# Altium schematic sheet Sheet1.SchDoc
size A
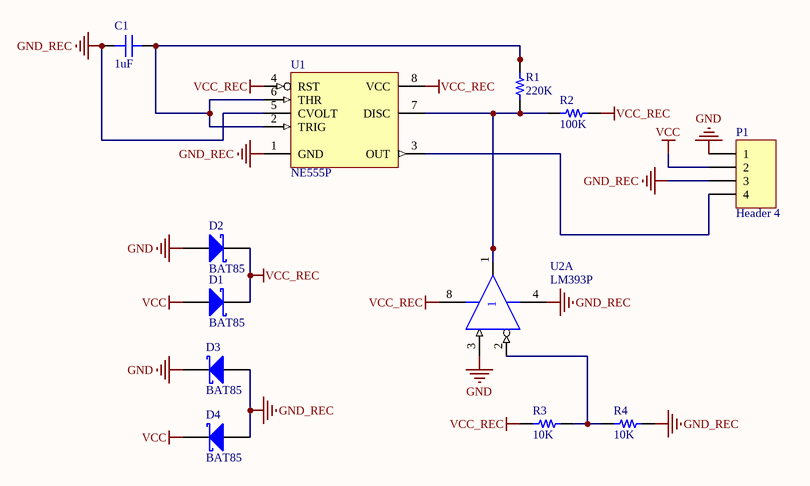
[diagram p0: Sheet1.SchDoc]

## Parts
C1  1uF  [CAP 0805/2012]
D1  BAT85  [SOD68]
D2  BAT85  [SOD68]
D3  BAT85  [SOD68]
D4  BAT85  [SOD68]
P1  Header 4  [HDR1X4]
R1  220K  [RES 0805/2012]
R2  100K  [RES 0805/2012]
R3  10K  [RES 0805/2012]
R4  10K  [RES 0805/2012]
U1  NE555P  [P008]
U2  LM393P  [P008]  (part A of 2)

## Nets
GND: D2.1(A) D3.2(K) P1.1 U2.3(IN+)
GND_REC: C1.1 D3.1(A) D4.1(A) P1.3 R4.1 U1.1(GND) U1.5(CVOLT) U2.4(GND)
VCC: D1.1(A) D4.2(K) P1.2
VCC_REC: D1.2(K) D2.2(K) R2.1 R3.2 U1.4(RST) U1.8(VCC) U2.8(VCC)
NetC1_2: C1.2 R1.2 U1.2(TRIG) U1.6(THR)
NetP1_4: P1.4 U1.3(OUT)
NetR1_1: R1.1 R2.2 U1.7(DISC) U2.1(OUT)
NetR3_1: R3.1 R4.2 U2.2(IN-)

## Library data of the parts
C1 = CC0805KRX7R9BB103: CAP CER 10000PF 50V X7R 0805; Manufacturer: Yageo; TemperatureRange: -55C ~ 125C; Tolerance: 10%; Value: 10000pF; Part Number: CC0805KRX7R9BB103; PartId: 5694; Supplier 1: Digi-Key; Supplier Part Number 1: 311-1136-2-ND; ComponentLink1Description: Datasheet; ComponentLink1URL: http://www.yageo.com/documents/recent/UPY-GPHC_X7R_6.3V-to-50V-v12.pdf; ComponentLink2Description: Digi-Key listing; ComponentLink2URL: http://digikey.com/product-detail/en/CC0805KRX7R9BB103/311-1136-2-ND/302870; TemperatureCoefficient: X7R; Voltage: 50V; Price: 0.0081; Type: -; Device Package: 0805 (2012 Metric)
D1-D4 = BAT85: Schottky Barrier Diode; Published: 17-Sep-2003; DatasheetVersion: 25-May-2000; PackageVersion: May-2000; PackageReference: SOD68; Publisher: Altium Limited; PackageDescription: Diode, Axial; Body 3 x 1.6 mm (LxDia. max), Lead Dia. 0.55 mm (max); Code_JEDEC: DO-204-AG; ComponentLink1Description: Manufacturer Link; ComponentLink1URL: http://www.semiconductors.philips.com/; ComponentLink2Description: Datasheet; ComponentLink2URL: http://www.semiconductors.philips.com/acrobat/datasheets/BAT85_4.pdf
P1 = Header 4: Header, 4-Pin; LatestRevisionDate: 17-Jul-2002; LatestRevisionNote: Re-released for DXP Platform.; Publisher: Altium Limited
R1-R4 = ERJ-6ENF49R9V: RES SMD 49.9 OHM 1% 1/8W 0805; Manufacturer: Panasonic Electronic Components; Value: 49.9; TemperatureRange: -55C ~ 155C; TemperatureCoefficient: 100ppm/C; PowerRating: 0.125W, 1/8W; Part Number: ERJ-6ENF49R9V; PartId: 1960; Supplier 1: Digi-Key; Supplier Part Number 1: P49.9CTR-ND; ComponentLink1Description: Datasheet; ComponentLink1URL: http://industrial.panasonic.com/www-cgi/jvcr13pz.cgi?E+PZ+3+AOA0002+ERJ6ENF49R9V+7+WW; ComponentLink2Description: Digi-Key listing; ComponentLink2URL: http://digikey.com/product-detail/en/ERJ-6ENF49R9V/P49.9CTR-ND/111027; Tolerance: 1%; Price: 0.0073; Type: Thick Film; Device Package: 0805 (2012 Metric)
U1 = NE555P: Precision Timer; Published: 16-Jan-2001; LatestRevisionDate: 04-Mar-2005; LatestRevisionNote: Stylized 3D Model Added.; DatasheetVersion: Feb-1992; PackageVersion: Jun-1999; PackageReference: P008; Publisher: Altium Limited; PackageDescription: DIP; 8 Leads; Row Spacing 7.62 mm; Pitch 2.54 mm; Code_JEDEC: MO-001-AN; ComponentLink1Description: Manufacturer Link; ComponentLink1URL: http://www.ti.com/; ComponentLink2Description: Datasheet; ComponentLink2URL: http://www-s.ti.com/sc/ds/ne555.pdf
U2 = LM393P: Dual Differential Comparator; Published: 15-Apr-2002; LatestRevisionDate: 04-Mar-2005; LatestRevisionNote: Stylized 3D Model Added.; DatasheetVersion: Nov-1988; PackageVersion: Jun-1999; PackageReference: P008; Publisher: Altium Limited; PackageDescription: DIP; 8 Leads; Row Spacing 7.62 mm; Pitch 2.54 mm; Code_JEDEC: MO-001-AN; ComponentLink1Description: Manufacturer Link; ComponentLink1URL: http://www.ti.com/; ComponentLink2Description: Datasheet; ComponentLink2URL: http://www-s.ti.com/sc/ds/lm193.pdf